# Altium schematic sheet commu.SchDoc
size A4
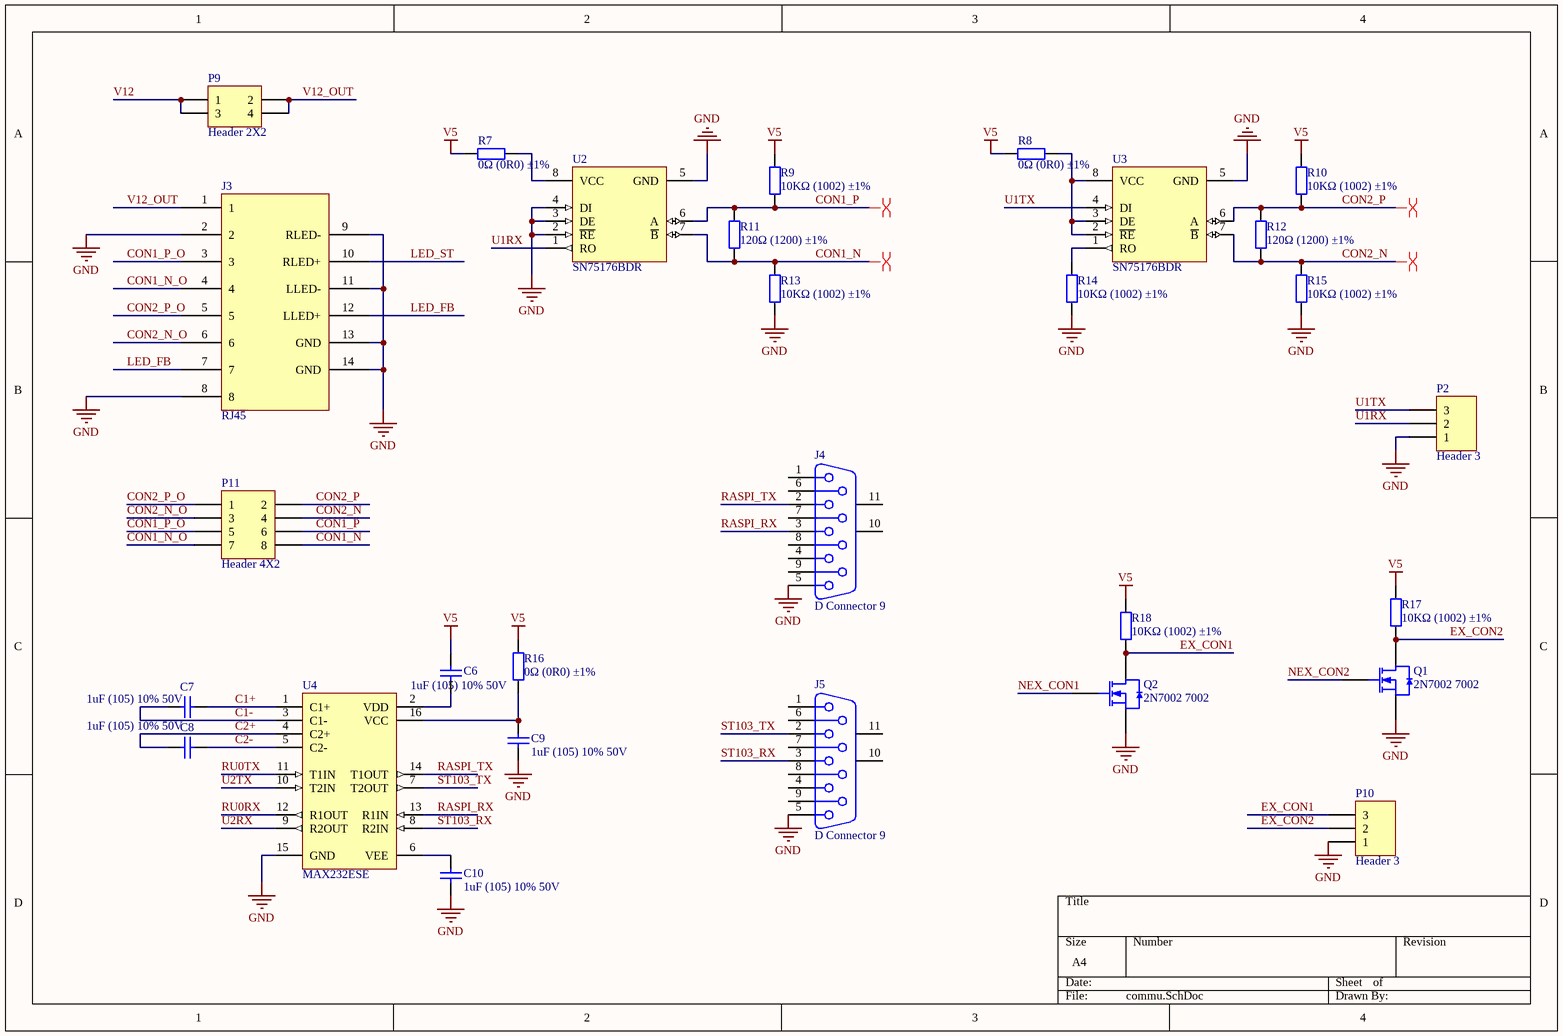
[diagram p0: commu.SchDoc]

## Parts
C6  1uF (105) 10% 50V  [0603_C]
C7  1uF (105) 10% 50V  [0603_C]
C8  1uF (105) 10% 50V  [0603_C]
C9  1uF (105) 10% 50V  [0603_C]
C10  1uF (105) 10% 50V  [0603_C]
J3  RJ45  [RJ45_1]
J4  D Connector 9  [DSUB1.385-2H9]
J5  D Connector 9  [DSUB1.385-2H9]
P2  Header 3  [HDR1X3]
P9  Header 2X2  [HDR2X2]
P10  Header 3  [HDR1X3]
P11  Header 4X2  [HDR2X4]
Q1  2N7002 7002  [SOT-23(SOT-23-3)]
Q2  2N7002 7002  [SOT-23(SOT-23-3)]
R7  0Ω (0R0) ±1%  [1206_R]
R8  0Ω (0R0) ±1%  [1206_R]
R9  10KΩ (1002) ±1%  [0603_R]
R10  10KΩ (1002) ±1%  [0603_R]
R11  120Ω (1200) ±1%  [0603_R]
R12  120Ω (1200) ±1%  [0603_R]
R13  10KΩ (1002) ±1%  [0603_R]
R14  10KΩ (1002) ±1%  [0603_R]
R15  10KΩ (1002) ±1%  [0603_R]
R16  0Ω (0R0) ±1%  [1206_R]
R17  10KΩ (1002) ±1%  [0603_R]
R18  10KΩ (1002) ±1%  [0603_R]
U2  SN75176BDR  [SOIC-8_150mil]
U3  SN75176BDR  [SOIC-8_150mil]
U4  MAX232ESE  [SOIC-16_150mil]

## Nets
GND: C9.1 C10.1 J3.2 J3.8 J3.9(RLED-) J3.11(LLED-) J3.13(GND) J3.14(GND) J4.5 J5.5 P2.1 P10.1 Q1.2(S) Q2.2(S) R13.1 R14.1 R15.1 U2.2(~{RE}) U2.3(DE) U2.4(DI) U2.5(GND) U3.5(GND) U4.15(GND)
V5: C6.2 R7.1 R8.1 R9.2 R10.2 R16.2 R17.2 R18.2
C1+: C7.2 U4.1(C1+)
C1-: C7.1 U4.3(C1-)
C2+: C8.1 U4.4(C2+)
C2-: C8.2 U4.5(C2-)
CON1_N: P11.8 R11.1 R13.2 U2.7(~{B})
CON1_N_O: J3.4 P11.7
CON1_P: P11.6 R9.1 R11.2 U2.6(A)
CON1_P_O: J3.3 P11.5
CON2_N: P11.4 R12.1 R15.2 U3.7(~{B})
CON2_N_O: J3.6 P11.3
CON2_P: P11.2 R10.1 R12.2 U3.6(A)
CON2_P_O: J3.5 P11.1
EX_CON1: P10.3 Q2.3(D) R18.1
EX_CON2: P10.2 Q1.3(D) R17.1
LED_FB: J3.7 J3.12(LLED+)
LED_ST: J3.10(RLED+)
NEX_CON1: Q2.1(G)
NEX_CON2: Q1.1(G)
RASPI_RX: J4.3 U4.13(R1IN)
RASPI_TX: J4.2 U4.14(T1OUT)
RU0RX: U4.12(R1OUT)
RU0TX: U4.11(T1IN)
ST103_RX: J5.3 U4.8(R2IN)
ST103_TX: J5.2 U4.7(T2OUT)
U1RX: P2.2 U2.1(RO)
U1TX: P2.3 U3.4(DI)
U2RX: U4.9(R2OUT)
U2TX: U4.10(T2IN)
V12: P9.1 P9.3
V12_OUT: J3.1 P9.2 P9.4
NetC6_1: C6.1 U4.2(VDD)
NetC9_2: C9.2 R16.1 U4.16(VCC)
NetC10_2: C10.2 U4.6(VEE)
NetR7_2: R7.2 U2.8(VCC)
NetR8_2: R8.2 U3.2(~{RE}) U3.3(DE) U3.8(VCC)
NetR14_2: R14.2 U3.1(RO)

Not connected (* = marked no-connect by the designer): J4 1 4 6 7 8 9 10(MH1) 11(MH2); J5 1 4 6 7 8 9 10(MH1) 11(MH2)

## Layout directives
differential pair: CON1_N, CON1_P, CON2_N, CON2_P

## Library data of the parts
C6-C10 = 0603 1uF (105) 10% 50V: 贴片电容; ComponentLink1Description: 供应商链接; ComponentLink1URL: http://www.szlcsc.com/product/details_16531.html; Package: 0603; Supplier: LC; SuppliersPartNumber: C15849
J3 = RJ45_1
J4 J5 = D Connector 9: Receptacle Assembly, 9 Position, Right Angle; PackageDocument: O; Positions: 9; Published: 15-Jun-2001; LatestRevisionDate: 17-Jul-2002; LatestRevisionNote: Re-released for DXP Platform.; DatasheetDocument: 1-Sep-1999; PackageReference: 788750; Publisher: Altium Limited; Orientation: Right Angle; Gender: Receptacle
P2 P10 = Header 3: Header, 3-Pin; LatestRevisionDate: 17-Jul-2002; LatestRevisionNote: Re-released for DXP Platform.; Publisher: Altium Limited
P9 = Header 2X2: Header, 2-Pin, Dual row; LatestRevisionDate: 17-Jul-2002; LatestRevisionNote: Re-released for DXP Platform.; Publisher: Altium Limited
P11 = Header 4X2: Header, 4-Pin, Dual row; LatestRevisionDate: 17-Jul-2002; LatestRevisionNote: Re-released for DXP Platform.; Publisher: Altium Limited
Q1 Q2 = 2N7002 7002: MOS(场效应管); ComponentLink1Description: 供应商链接; ComponentLink1URL: http://www.szlcsc.com/product/details_9040.html; Package: SOT-23(SOT-23-3); Supplier: LC; SuppliersPartNumber: C8545
R7 R8 R16 = 1206 0Ω (0R0) 1%: 贴片电阻; ComponentLink1Description: 供应商链接; ComponentLink1URL: http://www.szlcsc.com/product/details_18576.html; Package: 1206; Supplier: LC; SuppliersPartNumber: C17888
R9 R10 R13-R15 R17 R18 = 0603 10KΩ (1002) 1%: 贴片电阻; ComponentLink1Description: 供应商链接; ComponentLink1URL: http://www.szlcsc.com/product/details_26547.html; Package: 0603; Supplier: LC; SuppliersPartNumber: C25804
R11 R12 = 0603 120Ω (1200) 1%: 贴片电阻; ComponentLink1Description: 供应商链接; ComponentLink1URL: http://www.szlcsc.com/product/details_23514.html; Package: 0603; Supplier: LC; SuppliersPartNumber: C22787
U2 U3 = SN75176BDR_[C7063]: RS-485/RS-422; ComponentLink1Description: 供应商链接; ComponentLink1URL: http://www.szlcsc.com/product/details_7535.html; Package: SOIC-8_150mil; Supplier: LC; SuppliersPartNumber: C7063
U4 = MAX232ESE_[C26860]: RS232; ComponentLink1Description: 供应商链接; ComponentLink1URL: http://www.szlcsc.com/product/details_27608.html; Package: SOIC-16_150mil; Supplier: LC; SuppliersPartNumber: C26860